# Altium schematic sheet inverter_module.SchDoc
size A4
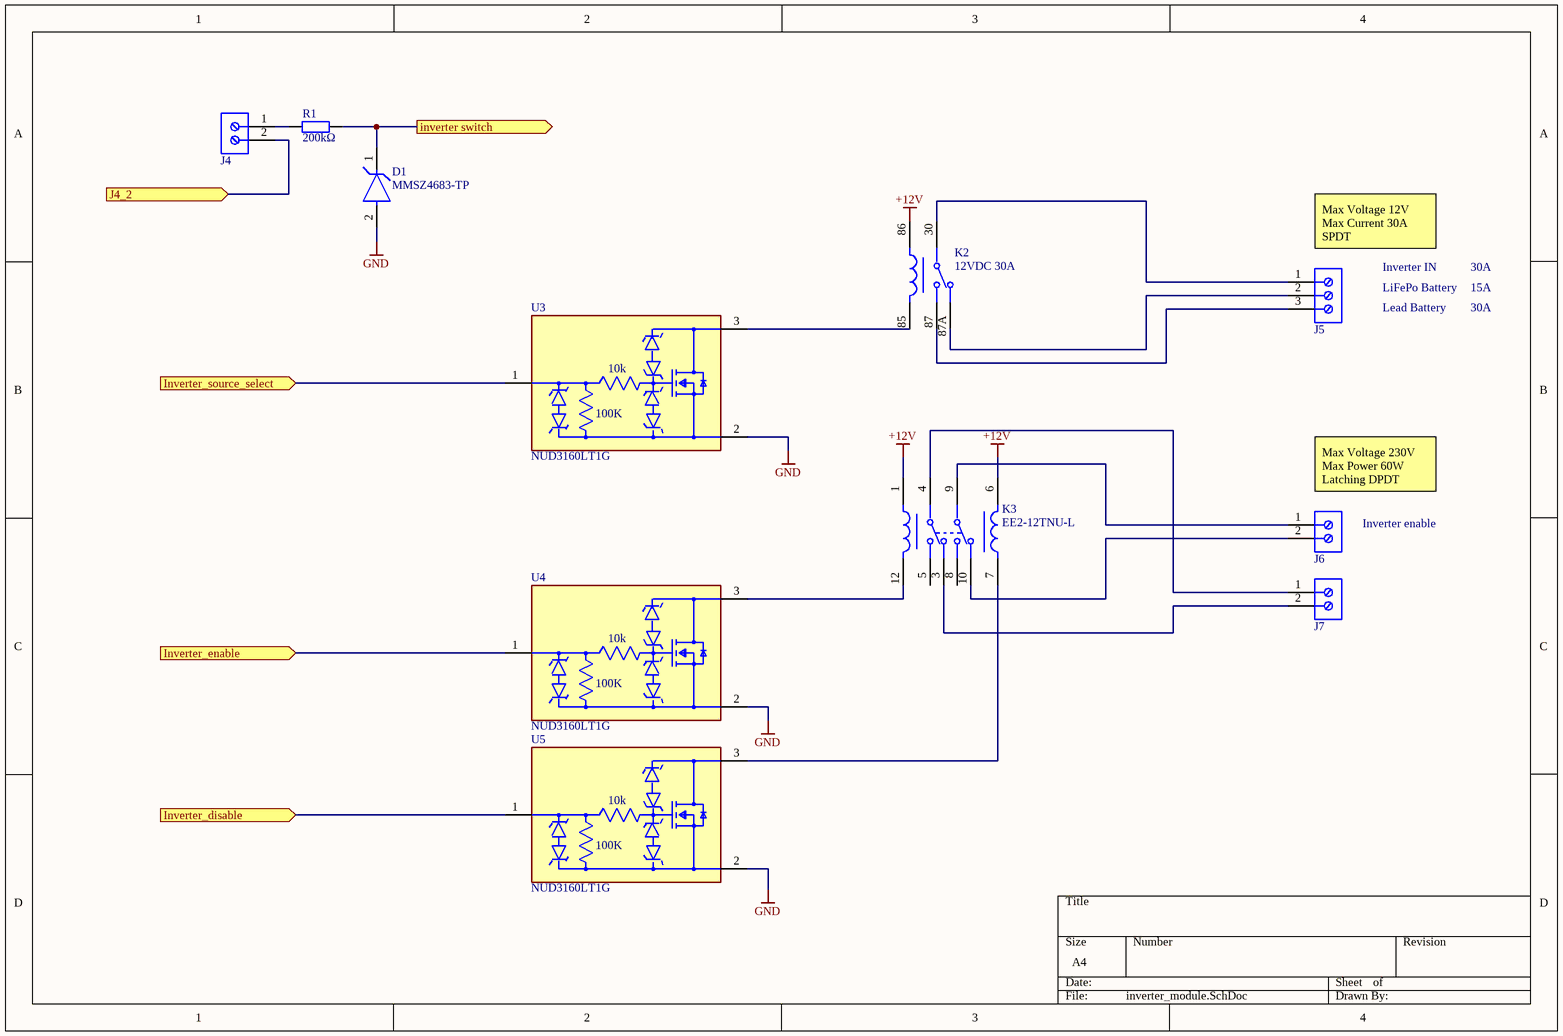
[diagram p0: inverter_module.SchDoc]

## Parts
D1  MMSZ4683-TP  [FP-SOD-123-MFG]
J4  282836-2  [TECO-282836-2_V]  (value not drawn)
J5  282836-3  [TE_282836-3]  (value not drawn)
J6  282836-2  [TECO-282836-2_V]  (value not drawn)
J7  282836-2  [TECO-282836-2_V]  (value not drawn)
K2  12VDC 30A  [automotive_relay]
K3  EE2-12TNU-L  [FP-EE2-12TNU-L-MFG]
R1  200kΩ  [RESC2013X50X30ML20T20]
U3  NUD3160LT1G  [FP-318-08-MFG]
U4  NUD3160LT1G  [FP-318-08-MFG]
U5  NUD3160LT1G  [FP-318-08-MFG]

## Ports
inverter switch (out), Inverter_disable (in), Inverter_enable (in), Inverter_source_select (in), J4_2 (in)

## Nets
+12V: K2.86 K3.1(SET+) K3.6(RESET+)
GND: D1.2(A) U3.2(Source) U4.2(Source) U5.2(Source)
inverter switch: D1.1(C) R1.1 ; port inverter switch
Inverter_disable: U5.1(Gate) ; port Inverter_disable
Inverter_enable: U4.1(Gate) ; port Inverter_enable
Inverter_source_select: U3.1(Gate) ; port Inverter_source_select
J4_2: J4.2 ; port J4_2
NetJ4_1: J4.1 R1.2
NetJ5_1: J5.1 K2.30
NetJ5_2: J5.2 K2.87A
NetJ5_3: J5.3 K2.87
NetJ6_1: J6.1 K3.9
NetJ6_2: J6.2 K3.10
NetJ7_1: J7.1 K3.4
NetJ7_2: J7.2 K3.3
NetK2_85: K2.85 U3.3(Drain)
NetK3_7: K3.7(RESET-) U5.3(Drain)
NetK3_12: K3.12(SET-) U4.3(Drain)

Not connected (* = marked no-connect by the designer): K3 5 8

## Notes on the sheet
- (near J5) Max Voltage 12V
  Max Current 30A
  SPDT
- Inverter IN
- LiFePo Battery
- Lead Battery
- 15A
- 30A
- (near J6) Max Voltage 230V
  Max Power 60W
  Latching DPDT
- (near J6) Inverter enable
- (in symbol CMP-07123-000002-1) 10k; 100K

## Library data of the parts
D1 = CMP-56208-000004-1: DIODE ZENER 3V 500MW SOD123; Element Configuration: Single; Voltage Tolerance: 5%; Peak Reverse Current: 800nA; Forward Voltage: 950mV; Package Quantity: 1; Packaging: Tape and Reel; Number of Pins: 2; Min Operating Temperature: -55°C; Radiation Hardening: No; Max Power Dissipation: 500mW; Power Dissipation: 500mW; Working Voltage: 3V; Max Operating Temperature: 150°C; Lead Free: Lead Free; Max Reverse Leakage Current: 800nA; Mount: Surface Mount; Zener Voltage: 3V; Tolerance: 5%
J4 J6 J7 = CMP-1684-00017-1: Female Header, Pitch 5 mm, 1 x 2 Position, Height 10 mm, Tail Length 3.5 mm, Rohs, Bulk; Manufacturer: TE Connectivity; Wire Gauge: 16-30AWG; Product Training Modules: Wire-to-BoardEurostyleTerminalBlocks; Clamp Material - Plating: Brass-NickelPlated; Voltage: 300V; Mating Orientation: HorizontalwithBoard; Current: 13.5A; Pitch: 0.197"(5.00mm); Screw Thread: M3; 3D Model: 282836-2.pdf; Other Names: 5ULV-02B / A98076; Dynamic Catalog: BuchananSeries; Number of Levels: 1; Torque - Screw: 0.68Nm(6Lb-In); Featured Product: EurostyleTerminalBlockConnectors; Positions Per Level: 2; Wire Termination: Screw-RisingCageClamp; Datasheet URL: http://www.te.com.cn/commerce/DocumentDelivery/DDEController?Action=showdoc&DocId=Catalog+Section%7F1308389_EUROSTYLE_TERMINAL_BLOCKS%7F0607%7Fpdf%7FEnglish%7FENG_CS_1308389_EUROSTYLE_TERMINAL_BLOCKS_0607.pdf%7F282836-2; Color: Green; Family: TerminalBlocks-WiretoBoard; RoHS Information: 282836-2StatementofCompliance; Standard Package: 300; Contact Material - Plating: Brass-TinPlated; Manufacturer URL: http://www.te.com; Housing Material: Polyamide(PA66),Nylon6/6; Features: Interlocking(Side); Package Description: Female Header, Pitch 5 mm, 1 x 2 Position, Height 10 mm, Tail Length 3.5 mm; Mounting Type: ThroughHole; Package Reference: THD; Packaging: Bulk; Series: Buchanan; Category: Connectors,Interconnects; Screw Material - Plating: Brass-NickelPlated
J5 = 282836-3: Connector, Terminal Block; Wire Receptacle; 3 Pos.; 16-30 AWG; 0.197 in. CL; Sid; Manufacturer: TE Connectivity; Plating: Brass; Number of Levels: 1; Number of Positions Per Level: 3; Current: 13.5A; Voltage: 300V; Closed End: No (Without); Interlock: Yes (With); Voltage Rating (AC): 250V; Pitch: 5mm; Wire Gauge (Max): 30AWG; Wire Gauge (Min): 16AWG; Tail Length: 3.5mm; Thread Size: M3; Approvals: UL; Supplier 1: Mouser; Manufacturer Part Number: 282836-3; RoHS: Yes; Category: Terminal Blocks; Stock 1: 394; Pricing 1: 1=0.96000, 10=0.57500, 50=0.57500, 100=0.48300, 600=0.45700, 1000=0.40600, 2600=0.36800, 4800=0.33000, 10000=0.33000, 11200=0.31700, 25600=0.31100 (USD); Mount: Through Hole,Board; Housing Color: Green; Contact Plating: Tin; Contact Material: Brass; Color: Green; Housing Material: Polyamide; Insulation Material: Nylon; Number of Rows: 1; Termination: Screw; Package Quantity: 200; Packaging: Bulk; Number of Positions: 3; Orientation: Straight; Series: Buchanan; Connector Type: Receptacle; Number of Contacts: 3; Screw Flange: No (Without); Screwless Terminal Block: No (Without); Side Stackable: Yes (With); Current Rating: 13.5A; Max Current Rating: 13.5A; Voltage Rating: 300V; Number of Circuits: 3; Max Supply Voltage (AC): 300V; Number of Poles: 3; Max Voltage Rating (AC): 300V; RMS Current (Irms): 13.5A; Working Voltage: 250V; Length: 15mm; Width: 10mm; Depth: 8.2mm; Wire/Cable Gauge: 16AWG; Radiation Hardening: No; Flammability Rating: UL94 V-0; RoHS Compliant: Yes; ELV: Compliant; REACH SVHC: Unknown; Lead Free: Lead Free; ComponentLink1URL: https://datasheet.ciiva.com/15169/getdatasheetpartid-155856-15169554.pdf?src-supplier=Verical; ComponentLink1Description: https://datasheet.ciiva.com/15169/getdatasheetpartid-155856-15169554.pdf?src-supplier=Verical; ComponentLink2URL: https://datasheet.ciiva.com/16305/eng-cs-1308389-eurostyle-terminal-blocks-0607-16305242.pdf?src-supplier=Future+Electronics; ComponentLink2Description: https://datasheet.ciiva.com/16305/eng-cs-1308389-eurostyle-terminal-blocks-0607-16305242.pdf?src-supplier=Future+Electronics; ComponentLink3URL: https://datasheet.ciiva.com/19460/750661-19460522.pdf?src-supplier=Jameco; ComponentLink3Description: https://datasheet.ciiva.com/19460/750661-19460522.pdf?src-supplier=Jameco; ComponentLink4URL: https://datasheet.ciiva.com/11757/0900766b8002dc8a-11757406.pdf?src-supplier=RSComponents; ComponentLink4Description: https://datasheet.ciiva.com/11757/0900766b8002dc8a-11757406.pdf?src-supplier=RSComponents; ComponentLink5URL: https://datasheet.ciiva.com/823/eng-cd-282836-h10-823445.pdf?src-supplier=Digi-Key; ComponentLink5Description: https://datasheet.ciiva.com/823/eng-cd-282836-h10-823445.pdf?src-supplier=Digi-Key; ComponentLink6URL: https://datasheet.ciiva.com/30106/eng-cs-1308389-eurostyle-terminal-blocks-0607-30106198.pdf?src-supplier=Onlinecomponents.com; ComponentLink6Description: https://datasheet.ciiva.com/30106/eng-cs-1308389-eurostyle-terminal-blocks-0607-30106198.pdf?src-supplier=Onlinecomponents.com; ComponentLink7URL: https://datasheet.ciiva.com/14606/70086276-14606907.pdf?src-supplier=Allied+Electronics; ComponentLink7Description: https://datasheet.ciiva.com/14606/70086276-14606907.pdf?src-supplier=Allied+Electronics; ComponentLink8URL: https://datasheet.ciiva.com/16649/eng-cs-1308389-eurostyle-terminal-blocks-0607-16649389.pdf?src-supplier=Avnet+Europe; ComponentLink8Description: https://datasheet.ciiva.com/16649/eng-cs-1308389-eurostyle-terminal-blocks-0607-16649389.pdf?src-supplier=Avnet+Europe; ComponentLink9URL: https://datasheet.ciiva.com/3141/eng-cs-1308389-eurostyle-terminal-blocks-0607-3141119.pdf?src-supplier=Avnet; ComponentLink9Description: https://datasheet.ciiva.com/3141/eng-cs-1308389-eurostyle-terminal-blocks-0607-3141119.pdf?src-supplier=Avnet; Supplier Part Number 1: 571-2828363
K2 = Relay automotive: Power Relay 12VDC 90(NO)/30(NC)A SPDT(26.5x26.5x24.5)mm Plug-In; Manufacturer: TE Connectivity; Manufacturer Part Number: 1432787-1; Throw Configuration: SPDT,DPDT; Coil Current: 151mA; Operate Time: 10ms; Release Time: 13ms; Coil Power: 1.8W; Coil Type: Non-Latching; Coil Resistance: 79.5R; Coil Voltage (DC): 12V; Current Rating: 40A; Voltage Rating (DC): 14V; Supplier 1: RSComponents; RoHS: Yes; Category: Power Relays; Stock 1: 124; Pricing 1: 1=5.77600, 10=5.49900, 25=5.22200, 50=4.76500, 150=4.16900 (USD); Mount: Socketable,Plug-In,Socket; Number of Pins: 5; Contact Material: Tin,Silver; Min Operating Temperature: -40°C; Max Operating Temperature: 85°C; Package Quantity: 100; Packaging: Bulk; Termination: Plug; Relay Type: Automotive; Contact Current Rating: 30A; Lead Free: Lead Free; ComponentLink1URL: https://datasheet.ciiva.com/30468/0900766b8122a645-30468979.pdf?src-supplier=RSComponents; ComponentLink1Description: https://datasheet.ciiva.com/30468/0900766b8122a645-30468979.pdf?src-supplier=RSComponents; ComponentLink2URL: https://datasheet.ciiva.com/30061/eng-cd-1432787-1-b-30061776.pdf?src-supplier=Onlinecomponents.com; ComponentLink2Description: https://datasheet.ciiva.com/30061/eng-cd-1432787-1-b-30061776.pdf?src-supplier=Onlinecomponents.com; Supplier Part Number 1: 7826947
K3 = CMP-03195-000019-1: RELAY GEN PURPOSE DPDT 2A 12VDC; Coil Power: 140mW; Operate Time: 2ms; Release Time: 1ms; Relay Type: General Purpose; Max Voltage Rating (DC): 220V; Coil Current: 11.7mA; Coil Type: Latching, Dual Coil; Coil Voltage (DC): 12V; Coil Resistance: 1.028kR; Max Voltage Rating (AC): 250V; Number of Poles: 1; Length: 15mm; Contact Current Rating: 2A; Height: 9mm; Radiation Hardening: No; Package Quantity: 500; Throw Configuration: DPDT; Max Operating Temperature: 85°C; REACH SVHC: No SVHC; Current Rating: 2A; Number of Pins: 10; Packaging: Tape and Reel; Power Consumption: 140mW; Termination: Gull Wing; RoHS Compliant: Yes; Mount: Surface Mount; Max Current Rating: 2A; Min Operating Temperature: -40°C; Contact Material: Gold; Depth: 7.5mm
R1 = Res_0805: Resistor
U3-U5 = CMP-07123-000002-1: IC INDCT LOAD DRVR INDUST SOT23; Manufacturer: ON Semiconductor; Max Power Dissipation: 225mW; Fall Time: 622ns; Max Supply Voltage: 60V; Propagation Delay: 1160ns; Output Current: 150mA; Output Voltage: 48V; Standoff Height: 0.01mm; Number Of Outputs: 1; Max Junction Temp: +150°C; Rise Time: 600ns; Temperature Range Low: -40°C; Mouser Description: MOSFET 61V Industrial Load Driver; Ambient Temperature Range High: +125°C; Octopart: https://octopart.com/nud3160lt1g-on+semiconductor-470723; Package: 318-08; Automotive: No; Temperature: -40°C to +150°C; RoHS: TRUE; Lead Free: Yes; Height: 1.11mm; Device Class L3: Gate Drivers; Ambient Temperature Range Low: -40°C; Device Class L2: Power Management ICs; Digikey Description: IC INDCT LOAD DRVR INDUST SOT23; Category: IC; Device Class L1: Integrated Circuits (ICs); Manufacturer Part Number: NUD3160LT1G; Footprint Url: https://www.onsemi.com/pub/Collateral/318-08.PDF; Number Of Drivers: 1; ComponentLink2Description: Datasheet; Temperature Range High: +150°C; ComponentLink2URL: https://www.onsemi.com/pub/Collateral/NUD3160-D.PDF